# Altium project ESP32-PicoDK.PrjPCB
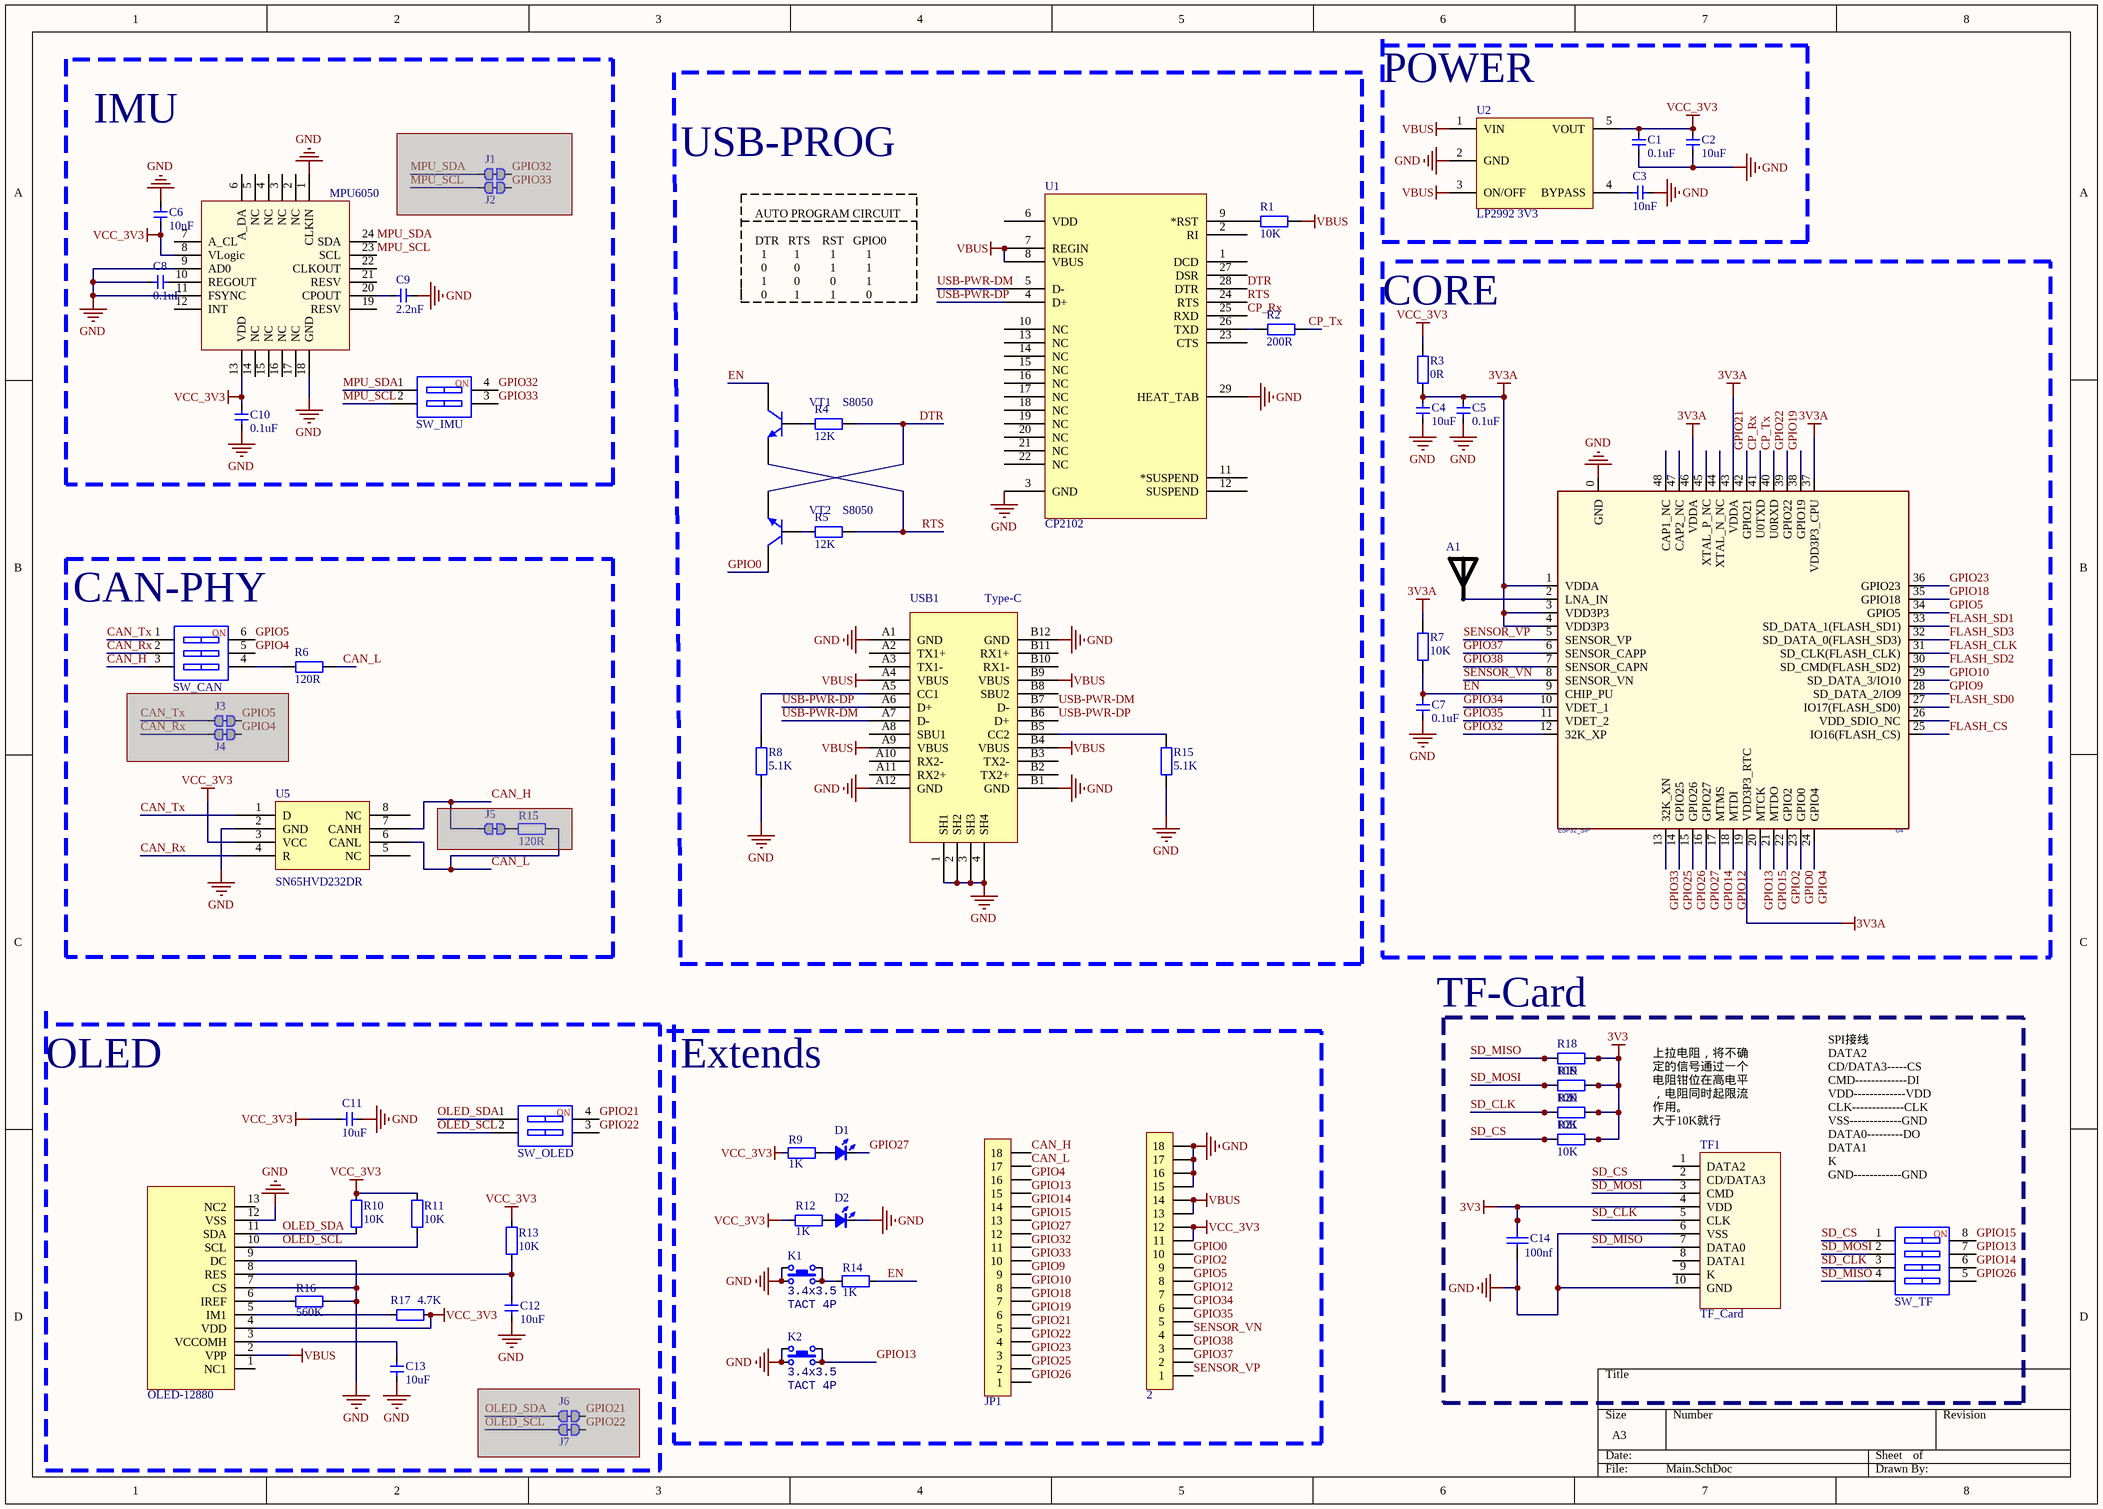
[diagram p0: Main.SchDoc]
1 sheet, 64 parts. Net scope: global (net labels, ports and power ports of the same name join across sheets).
Board file: ESP32-PicoDK.PcbDoc

## Sheet Main.SchDoc
size A3

### Parts
(Parts that share a designator on the sheet are numbered #1, #2 ... from top to bottom, then left to right.)
1  OLED-12880  [OLED-12880]
2  HDR-1X18  [HDR2.54-LI-18P]  (value not drawn)
A1  RAINSUN  [ANT-Rainsun-AN5120]  (value not drawn)
C1  0.1uF  [CAP_0402]
C2  10uF  [CAP_0402]
C3  10nF  [CAP_0402]
C4  10uF  [CAP_0402]
C5  0.1uF  [CAP_0402]
C6  10nF  [CAP_0402]
C7  0.1uF  [CAP_0402]
C8  0.1uF  [CAP_0402]
C9  2.2nF  [CAP_0402]
C10  0.1uF  [CAP_0402]
C11  10uF  [CAP_0402]
C12  10uF  [CAP_0402]
C13  10uF  [CAP_0402]
C14  100nf  [C0402_L]
D1  color?  [LED_0402_RED]  (value not drawn)
D2  color?  [LED_0402_RED]  (value not drawn)
J1  跳线  [0402-0R]  (value not drawn)  (masked out: inside a compile mask, not in the netlist)
J2  跳线  [0402-0R]  (value not drawn)  (masked out: inside a compile mask, not in the netlist)
J3  跳线  [0402-0R]  (value not drawn)  (masked out: inside a compile mask, not in the netlist)
J4  跳线  [0402-0R]  (value not drawn)  (masked out: inside a compile mask, not in the netlist)
J5  跳线  [0402-0R]  (value not drawn)  (masked out: inside a compile mask, not in the netlist)
J6  跳线  [0402-0R]  (value not drawn)  (masked out: inside a compile mask, not in the netlist)
J7  跳线  [0402-0R]  (value not drawn)  (masked out: inside a compile mask, not in the netlist)
JP1  HDR-1X18  [HDR2.54-LI-18P]  (value not drawn)
K1  value 3.4x3.5  [SW-SMD_4P-L4.2-W3.3-P2.15-LS5.1]  (hidden comment: TACT 4P)
K2  value 3.4x3.5  [SW-SMD_4P-L4.2-W3.3-P2.15-LS5.1]  (hidden comment: TACT 4P)
R1  10K  [R0402_L]
R2  200R  [R0402_L]
R3  0R  [R0402_L]
R4  12K  [R0402_L]
R5  12K  [R0402_L]
R6  120R  [R0402_L]
R7  10K  [R0402_L]
R8  5.1K  [R0402_L]
R9  1K  [RES_0402]
R10  10K  [RES_0402]
R11  10K  [RES_0402]
R12  1K  [RES_0402]
R13  10K  [RES_0402]
R14  1K  [RES_0402]
R15#1  5.1K  [R0402_L]
R15#2  120R  [RES_0402]  (masked out: inside a compile mask, not in the netlist)
R16  560K  [RES_0402]
R17  4.7K  [RES_0402]
R18  10K  [R0402_L]
R19  10K  [R0402_L]
R20  10K  [R0402_L]
R21  10K  [R0402_L]
SW_CAN  SW-3P  [SW1.27 SMD-3P]  (value not drawn)
SW_IMU  SW-2P  [SW1.27 SMD-2P]  (value not drawn)
SW_OLED  SW-2P  [SW1.27 SMD-2P]  (value not drawn)
SW_TF  SW-4P  [SW1.27 SMD-4P]  (value not drawn)
TF1  TF_Card  [Micro SD]
U1  CP2102  [QFN-28]
U2  LP2992 3V3  [SOT23-5]
U3  MPU6050  [QFN-24]
U4  ESP32_SIP  [QFN-48_7X7]
U5  Manufacturer Part Number: SN65HVD232DR  [SO-8]  (hidden comment: SN65HVD232D)
USB1  Type-C  [Type-C-TOP]
VT1  S8050  [SMT_TRIODE_NPN]
VT2  S8050  [SMT_TRIODE_NPN]

### Blocks framed on the sheet
USB-PROG: R1 R2 R4 R5 R8 R15#1 U1 USB1 VT1 VT2
CAN-PHY: J3-J5 R6 R15#2 SW_CAN U5

### Nets
3V3: C14.2 R18.2 R19.2 R20.2 R21.2 TF1.4(VDD)
3V3A: C4.2 C5.2 R3.2 R7.2 U4.1(VDDA) U4.3(VDD3P3) U4.4(VDD3P3) U4.19(VDD3P3_RTC) U4.37(VDD3P3_CPU) U4.43(VDDA) U4.46(VDDA)
GND: 1.7(CS) 1.9(DC) 1.12(VSS) 2.15 2.16 2.17 2.18 C1.1 C2.1 C3.1 C4.1 C5.1 C6.2 C7.2 C8.2 C9.1 C10.1 C11.1 C12.1 C13.1 C14.1 D2.2(K) K1.1 K1.3 K2.1 K2.3 R8.1 R15#1.1 R16.2 TF1.6(VSS) TF1.10(GND) U1.3(GND) U1.29(HEAT_TAB) U2.2(GND) U3.1(CLKIN) U3.9(AD0) U3.11(FSYNC) U3.18(GND) U4.0(GND) U5.2(GND) USB1.1(SH1) USB1.2(SH2) USB1.3(SH3) USB1.4(SH4) USB1.A1(GND) USB1.A12(GND) USB1.B1(GND) USB1.B12(GND)
VBUS: 1.2(VPP) 2.13 2.14 R1.2 U1.7(REGIN) U1.8(VBUS) U2.1(VIN) U2.3(ON/OFF) USB1.A4(VBUS) USB1.A9(VBUS) USB1.B4(VBUS) USB1.B9(VBUS)
VCC_3V3: 1.4(VDD) 2.11 2.12 C1.2 C2.2 C6.1 C10.2 C11.2 R3.1 R9.1 R10.2 R11.2 R12.1 R13.2 R17.2 U2.5(VOUT) U3.8(VLogic) U3.13(VDD) U5.3(VCC)
CAN_H: JP1.18 SW_CAN.3 U5.7(CANH)
CAN_L: JP1.17 R6.2 U5.6(CANL)
CAN_Rx: SW_CAN.2 U5.4(R)
CAN_Tx: SW_CAN.1 U5.1(D)
CP_Rx: U1.25(RXD) U4.41(U0TXD)
CP_Tx: R2.2 U4.40(U0RXD)
DTR: R4.2 U1.28(DTR) VT2.2(E)
EN: C7.1 R7.1 R14.2 U4.9(CHIP_PU) VT1.3(C)
FLASH_CLK: U4.31(SD_CLK(FLASH_CLK))
FLASH_CS: U4.25(IO16(FLASH_CS))
FLASH_SD0: U4.27(IO17(FLASH_SD0))
FLASH_SD1: U4.33(SD_DATA_1(FLASH_SD1))
FLASH_SD2: U4.30(SD_CMD(FLASH_SD2))
FLASH_SD3: U4.32(SD_DATA_0(FLASH_SD3))
GPIO0: 2.10 U4.23(GPIO0) VT2.3(C)
GPIO2: 2.9 U4.22(GPIO2)
GPIO4: JP1.16 SW_CAN.5 U4.24(GPIO4)
GPIO5: 2.8 SW_CAN.6 U4.34(GPIO5)
GPIO9: JP1.9 U4.28(SD_DATA_2/IO9)
GPIO10: JP1.8 U4.29(SD_DATA_3/IO10)
GPIO12: 2.7 U4.18(MTDI)
GPIO13: JP1.15 K2.2 K2.4 SW_TF.7 U4.20(MTCK)
GPIO14: JP1.14 SW_TF.6 U4.17(MTMS)
GPIO15: JP1.13 SW_TF.8 U4.21(MTDO)
GPIO18: JP1.7 U4.35(GPIO18)
GPIO19: JP1.6 U4.38(GPIO19)
GPIO21: JP1.5 SW_OLED.4 U4.42(GPIO21)
GPIO22: JP1.4 SW_OLED.3 U4.39(GPIO22)
GPIO23: JP1.3 U4.36(GPIO23)
GPIO25: JP1.2 U4.14(GPIO25)
GPIO26: JP1.1 SW_TF.5 U4.15(GPIO26)
GPIO27: D1.2(K) JP1.12 U4.16(GPIO27)
GPIO32: JP1.11 SW_IMU.4 U4.12(32K_XP)
GPIO33: JP1.10 SW_IMU.3 U4.13(32K_XN)
GPIO34: 2.6 U4.10(VDET_1)
GPIO35: 2.5 U4.11(VDET_2)
GPIO37: 2.2 U4.6(SENSOR_CAPP)
GPIO38: 2.3 U4.7(SENSOR_CAPN)
MPU_SCL: SW_IMU.2 U3.23(SCL)
MPU_SDA: SW_IMU.1 U3.24(SDA)
OLED_SCL: 1.10(SCL) R11.1 SW_OLED.2
OLED_SDA: 1.11(SDA) R10.1 SW_OLED.1
RTS: R5.2 U1.24(RTS) VT1.2(E)
SD_CLK: R20.1 SW_TF.3 TF1.5(CLK)
SD_CS: R21.1 SW_TF.1 TF1.2(CD/DATA3)
SD_MISO: R18.1 SW_TF.4 TF1.7(DATA0)
SD_MOSI: R19.1 SW_TF.2 TF1.3(CMD)
SENSOR_VN: 2.4 U4.8(SENSOR_VN)
SENSOR_VP: 2.1 U4.5(SENSOR_VP)
USB-PWR-DM: U1.5(D-) USB1.A7(D-) USB1.B7(D-)
USB-PWR-DP: U1.4(D+) USB1.A6(D+) USB1.B6(D+)
Net1_3: 1.3(VCCOMH) C13.2
Net1_5: 1.5(IM1) R17.1
Net1_6: 1.6(IREF) R16.1
Net1_8: 1.8(RES) C12.2 R13.1
NetA1_1: A1.1 U4.2(LNA_IN)
NetC3_2: C3.2 U2.4(BYPASS)
NetC8_1: C8.1 U3.10(REGOUT)
NetC9_2: C9.2 U3.20(CPOUT)
NetD1_1: D1.1(A) R9.2
NetD2_1: D2.1(A) R12.2
NetK1_2: K1.2 K1.4 R14.1
NetR1_1: R1.1 U1.9(*RST)
NetR2_1: R2.1 U1.26(TXD)
NetR4_1: R4.1 VT1.1(B)
NetR5_1: R5.1 VT2.1(B)
NetR6_1: R6.1 SW_CAN.4
NetR8_2: R8.2 USB1.A5(CC1)
NetR15#1_2: R15#1.2 USB1.B5(CC2)

Not connected (* = marked no-connect by the designer): 1 1(NC1) 13(NC2); TF1 1(DATA2) 8(DATA1) 9(K); U1 1(DCD) 2(RI) 6(VDD) 10(NC) 11(*SUSPEND) 12(SUSPEND) 13(NC) 14(NC) 15(NC) 16(NC) 17(NC) 18(NC) 19(NC) 20(NC) 21(NC) 22(NC) 23(CTS) 27(DSR); U3 2(NC) 3(NC) 4(NC) 5(NC) 6(A_DA) 7(A_CL) 12(INT) 14(NC) 15(NC) 16(NC) 17(NC) 19(RESV) 21(RESV) 22(CLKOUT); U4 26(VDD_SDIO_NC) 44(XTAL_N_NC) 45(XTAL_P_NC) 47(CAP2_NC) 48(CAP1_NC); U5 5(NC) 8(NC); USB1 A2(TX1+) A3(TX1-) A8(SBU1) A10(RX2-) A11(RX2+) B2(TX2+) B3(TX2-) B8(SBU2) B10(RX1-) B11(RX1+)

### Notes on the sheet
- (near U2) POWER
- IMU
- AUTO PROGRAM CIRCUIT
  DTR   RTS    RST   GPIO0
  1         1          1          1
  0         0          1          1
  1         0          0          1
  0         1          1          0
- (near R3) CORE
- (near R18) TF-Card
- OLED
- Extends
- (near TF1) 上拉电阻，将不确定的信号通过一个电阻钳位在高电平，电阻同时起限流作用。
  大于10K就行
- SPI接线
  DATA2
  CD/DATA3-----CS
  CMD-------------DI
  VDD-------------VDD
  CLK-------------CLK
  VSS-------------GND
  DATA0---------DO
  DATA1
  K
  GND------------GND
- (in symbol SW-2P) NO
- (in symbol SW-3P) NO
- (in symbol SW-4P) NO

### Library data of the parts
2 JP1 = Header 18: 18P接插件; 封装库来自淘宝卖家 ID：黄晶宝石: 其他店铺购入均为盗版假冒封装库; 联系卖家，免费查找封装: 唯一出售店铺网址https://shop463601444.taobao.com; BOM名称: 18P接插件
A1 = ANT-Rainsun-AP5120
C1-C13 = 电容-0402: Capacitor; Value: 0.1u
C14 = C: Capacitor; BOM名称: 无极性贴片电容; 联系卖家，免费查找封装: 唯一出售店铺网址https://shop463601444.taobao.com; 封装库来自淘宝卖家ID：黄晶宝石: 其他店铺购入均为盗版假冒封装库，请立即申请退款
D1 D2 = LED_0402: LED; Type: 0402; Value: color?
J1-J7 = 跳线: Resistor; Published: 8-Jun-2000; LatestRevisionDate: 17-Jul-2002; LatestRevisionNote: Re-released for DXP Platform.; PackageReference: AXIAL-0.4; Publisher: Altium Limited; PackageDescription: Axial Device, Thru-Hole; 2 Leads; 0.4 in Pin Spacing
K1 K2 = ButtonTACT: Button; pin to pad: 2>3 3>2; type: TACT 4P
R1-R8 R15#1 R18-R21 = R: 贴片电阻; 联系卖家，免费查找封装: 唯一出售店铺网址https://shop463601444.taobao.com; 封装库来自淘宝卖家ID：黄晶宝石: 其他店铺购入均为盗版假冒封装库，请立即申请退款; BOM名称: 贴片电阻
R9-R14 R15#2 R16 R17 = 电阻-0402: Resistor; Value: 22R
SW_CAN = SW-3P: 3路编码开关; 联系卖家，免费查找封装: 唯一出售店铺网址https://shop463601444.taobao.com; BOM名称: 3路编码开关
SW_IMU SW_OLED = SW-2P: 2路编码开关; 联系卖家，免费查找封装: 唯一出售店铺网址https://shop463601444.taobao.com; BOM名称: 2路编码开关
SW_TF = SW-4P: 4路编码开关; 联系卖家，免费查找封装: 唯一出售店铺网址https://shop463601444.taobao.com; BOM名称: 4路编码开关
TF1 = TF_Card: TF卡座; 联系卖家，免费技术支持: 唯一出售店铺网址https://shop463601444.taobao.com; BOM名称: TF卡座
U1 = CP2102: USB转TTL; PART DESC: SINGLE-CHIP USB TO UART BRIDGE, QFN28, RoHS.; MFG #1: SILICON LABS; PART NUMBER: CP2102; Value: Value; RefDes: RefDes; Type: DEV
U2 = LP2992: LDO
U3 = MPU6050: 六轴传感器
U4 = ESP32-PICO
U5 = SN65HVD232D: Manufacturer: Texas Instruments; Protocol: CAN; Number of Drivers/Receivers: 1/1; Duplex: Half; Data Rate: 1Mbps; Voltage - Supply: 3 V ~ 3.6 V; Supplier 1: Digi-Key; Supplier Part Number 1: 296-26344-2-ND; RoHS: RoHS Compliant; Category: Integrated Circuits (ICs); Stock: 5000; Pricing 1: 2500=0.84375 (USD); Packaging: Tape & Reel (TR); Part Status: Active; Type: Transceiver; Operating Temperature: -40°C ~ 85°C; Mounting Type: Surface Mount; Package / Case: 8-SOIC (0.154", 3.90mm Width); Supplier Device Package: 8-SOIC; ComponentLink1URL: http://www.ti.com/lit/ds/symlink/sn65hvd230.pdf; ComponentLink1Description: http://www.ti.com/lit/ds/symlink/sn65hvd230.pdf; Supplier 2: Digi-Key; Supplier Part Number 2: 296-26344-1-ND; Pricing 2: 1=2.05, 10=1.842, 100=1.4809, 500=1.21668, 1000=1.00811 (USD)
USB1 = USB-Type-C-TOP
VT1 VT2 = SMT_TRIODE_NPN: Surface mount NPN transistor, package SOT-23